# Altium schematic sheet Breakout.SchDoc
size B; SheetNumber: 1; SheetTotal: 1
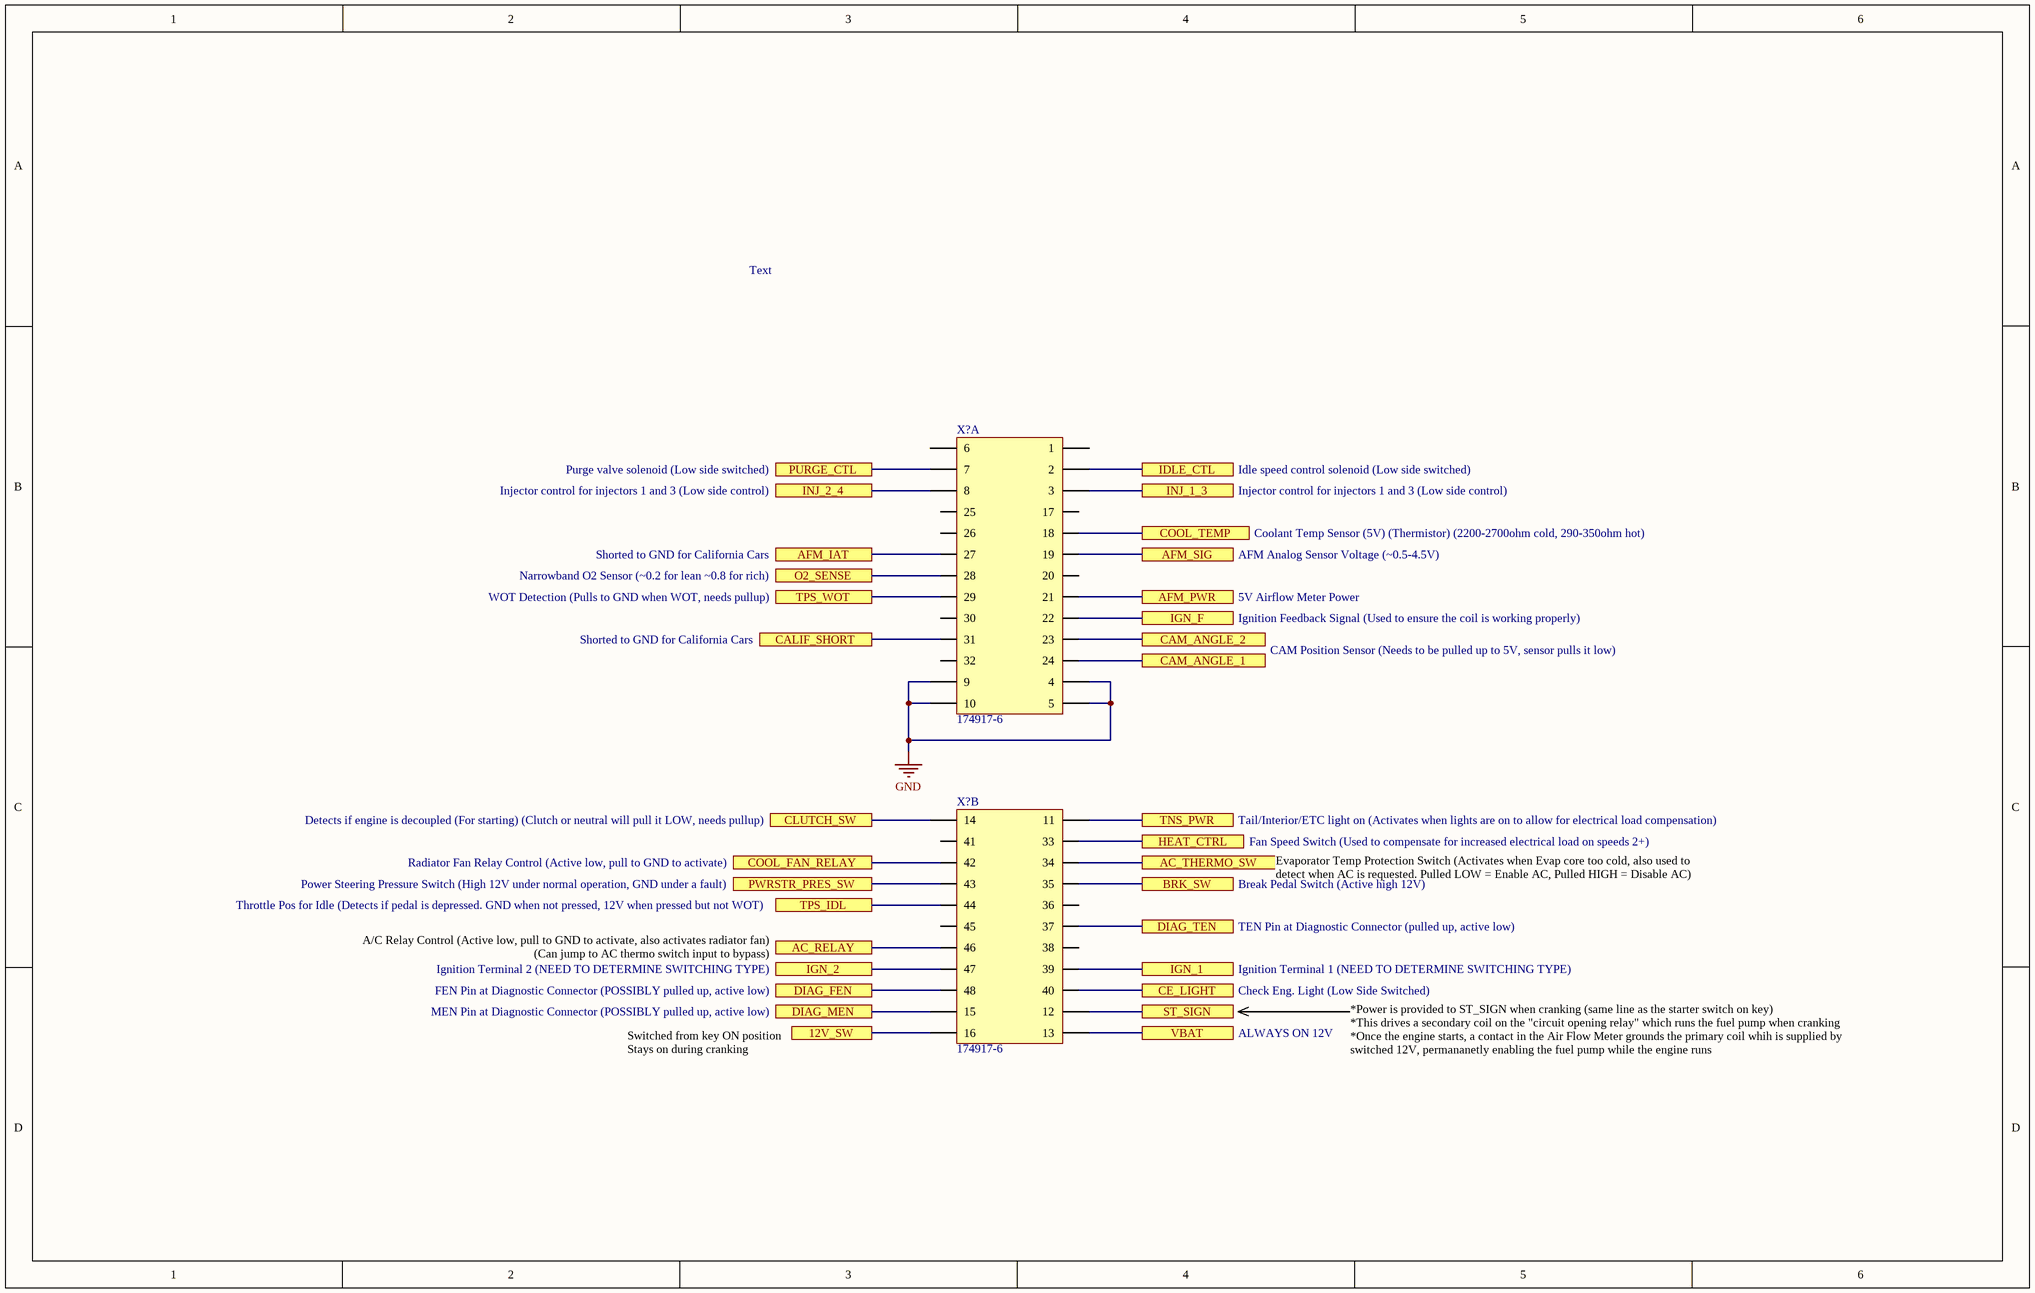
[diagram p0: Breakout.SchDoc]

## Parts
(Parts that share a designator on the sheet are numbered #1, #2 ... from top to bottom, then left to right.)
X?#1  174917-6  [174917-6]  (part A of 2)
X?#2  174917-6  [174917-6]  (part B of 2)

## Ports
12V_SW, AC_RELAY, AC_THERMO_SW, AFM_IAT, AFM_PWR, AFM_SIG, BRK_SW, CALIF_SHORT, CAM_ANGLE_1, CAM_ANGLE_2, CE_LIGHT, CLUTCH_SW, COOL_FAN_RELAY, COOL_TEMP, DIAG_FEN, DIAG_MEN, DIAG_TEN, HEAT_CTRL, IDLE_CTL, IGN_1, IGN_2, IGN_F, INJ_1_3, INJ_2_4, O2_SENSE, PURGE_CTL, PWRSTR_PRES_SW, ST_SIGN, TNS_PWR, TPS_IDL, TPS_WOT, VBAT

## Nets
GND: X?#1.4 X?#1.5 X?#1.9 X?#1.10
12V_SW: X?#2.16 ; port 12V_SW
AC_RELAY: X?#2.46 ; port AC_RELAY
AC_THERMO_SW: X?#2.34 ; port AC_THERMO_SW
AFM_IAT: X?#1.27 ; port AFM_IAT
AFM_PWR: X?#1.21 ; port AFM_PWR
AFM_SIG: X?#1.19 ; port AFM_SIG
BRK_SW: X?#2.35 ; port BRK_SW
CALIF_SHORT: X?#1.31 ; port CALIF_SHORT
CAM_ANGLE_1: X?#1.24 ; port CAM_ANGLE_1
CAM_ANGLE_2: X?#1.23 ; port CAM_ANGLE_2
CE_LIGHT: X?#2.40 ; port CE_LIGHT
CLUTCH_SW: X?#2.14 ; port CLUTCH_SW
COOL_FAN_RELAY: X?#2.42 ; port COOL_FAN_RELAY
COOL_TEMP: X?#1.18 ; port COOL_TEMP
DIAG_FEN: X?#2.48 ; port DIAG_FEN
DIAG_MEN: X?#2.15 ; port DIAG_MEN
DIAG_TEN: X?#2.37 ; port DIAG_TEN
HEAT_CTRL: X?#2.33 ; port HEAT_CTRL
IDLE_CTL: X?#1.2 ; port IDLE_CTL
IGN_1: X?#2.39 ; port IGN_1
IGN_2: X?#2.47 ; port IGN_2
IGN_F: X?#1.22 ; port IGN_F
INJ_1_3: X?#1.3 ; port INJ_1_3
INJ_2_4: X?#1.8 ; port INJ_2_4
O2_SENSE: X?#1.28 ; port O2_SENSE
PURGE_CTL: X?#1.7 ; port PURGE_CTL
PWRSTR_PRES_SW: X?#2.43 ; port PWRSTR_PRES_SW
ST_SIGN: X?#2.12 ; port ST_SIGN
TNS_PWR: X?#2.11 ; port TNS_PWR
TPS_IDL: X?#2.44 ; port TPS_IDL
TPS_WOT: X?#1.29 ; port TPS_WOT
VBAT: X?#2.13 ; port VBAT

Not connected (* = marked no-connect by the designer): X?#1 1 6 17 20 25 26 30 32; X?#2 36 38 41 45

## Notes on the sheet
- Text
- Injector control for injectors 1 and 3 (Low side control)
- Purge valve solenoid (Low side switched)
- Idle speed control solenoid (Low side switched)
- Narrowband O2 Sensor (~0.2 for lean ~0.8 for rich)
- Shorted to GND for California Cars
- AFM Analog Sensor Voltage (~0.5-4.5V)
- Coolant Temp Sensor (5V) (Thermistor) (2200-2700ohm cold, 290-350ohm hot)
- WOT Detection (Pulls to GND when WOT, needs pullup)
- Ignition Feedback Signal (Used to ensure the coil is working properly)
- 5V Airflow Meter Power
- CAM Position Sensor (Needs to be pulled up to 5V, sensor pulls it low)
- Detects if engine is decoupled (For starting) (Clutch or neutral will pull it LOW, needs pullup)
- Tail/Interior/ETC light on (Activates when lights are on to allow for electrical load compensation)
- Fan Speed Switch (Used to compensate for increased electrical load on speeds 2+)
- Radiator Fan Relay Control (Active low, pull to GND to activate)
- Power Steering Pressure Switch (High 12V under normal operation, GND under a fault)
- Throttle Pos for Idle (Detects if pedal is depressed. GND when not pressed, 12V when pressed but not WOT)
- Break Pedal Switch (Active high 12V)
- Evaporator Temp Protection Switch (Activates when Evap core too cold, also used to detect when AC is requested. Pulled LOW = Enable AC, Pulled HIGH = Disable AC)
- A/C Relay Control (Active low, pull to GND to activate, also activates radiator fan) (Can jump to AC thermo switch input to bypass)
- Ignition Terminal 2 (NEED TO DETERMINE SWITCHING TYPE)
- Ignition Terminal 1 (NEED TO DETERMINE SWITCHING TYPE)
- TEN Pin at Diagnostic Connector (pulled up, active low)
- MEN Pin at Diagnostic Connector (POSSIBLY pulled up, active low)
- FEN Pin at Diagnostic Connector (POSSIBLY pulled up, active low)
- ALWAYS ON 12V
- Check Eng. Light (Low Side Switched)
- Switched from key ON position
  Stays on during cranking
- *Power is provided to ST_SIGN when cranking (same line as the starter switch on key)
  *This drives a secondary coil on the "circuit opening relay" which runs the fuel pump when cranking
  *Once the engine starts, a contact in the Air Flow Meter grounds the primary coil whih is supplied by switched 12V, permananetly enabling the fuel pump while the engine runs

## Library data of the parts
X?#1 X?#2 = 174917-6: PCB Mount Header, Right Angle, Wire-to-Board, 48 Position, 3.5 mm / 3 mm [.138 in / .118 in] Centerline, Fully Shrouded, Multilock Connector System; ComponentLink1Description: TE; ComponentLink1URL: https://www.te.com/en/product-174917-6.html